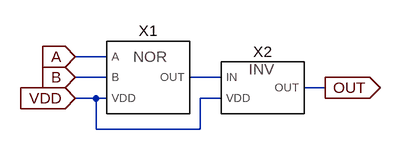
[diagram p0: schematic OrCMOS.asc]
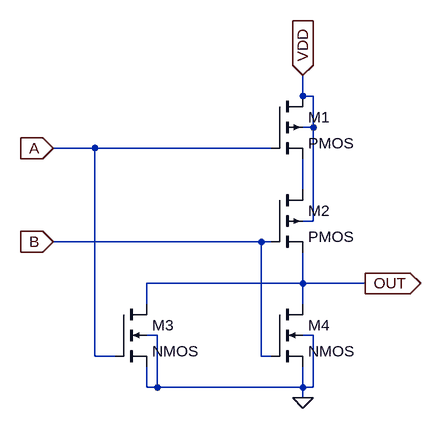
[diagram p1: sub-circuit norcmos.asc]
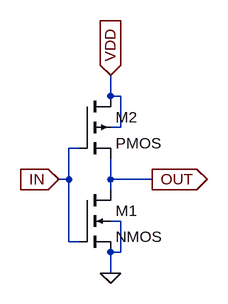
[diagram p2: sub-circuit invcmos.asc]
OrCMOS.asc, the LTspice schematic file:
Version 4
SHEET 1 880 680
WIRE 112 128 64 128
WIRE 112 160 64 160
WIRE 288 160 240 160
WIRE 448 176 416 176
WIRE 96 192 64 192
WIRE 112 192 96 192
WIRE 288 192 256 192
WIRE 96 240 96 192
WIRE 256 240 256 192
WIRE 256 240 96 240
FLAG 64 128 A
IOPIN 64 128 In
FLAG 64 160 B
IOPIN 64 160 In
FLAG 64 192 VDD
IOPIN 64 192 In
FLAG 448 176 OUT
IOPIN 448 176 Out
SYMBOL NorCMOS 176 160 R0
SYMATTR InstName X1
SYMBOL InvCMOS 352 176 R0
SYMATTR InstName X2

norcmos.asc, the sub-circuit schematic file:
Version 4
SHEET 1 880 680
WIRE 224 16 224 -16
WIRE 240 16 224 16
WIRE 240 64 240 16
WIRE 240 64 224 64
WIRE -96 96 -160 96
WIRE 176 96 -96 96
WIRE 224 160 224 112
WIRE 240 208 240 64
WIRE 240 208 224 208
WIRE 160 240 -160 240
WIRE 176 240 160 240
WIRE 224 304 224 256
WIRE 224 304 -16 304
WIRE 320 304 224 304
WIRE -16 336 -16 304
WIRE 224 336 224 304
WIRE 0 384 -16 384
WIRE 240 384 224 384
WIRE -96 416 -96 96
WIRE -64 416 -96 416
WIRE 160 416 160 240
WIRE 176 416 160 416
WIRE -16 464 -16 432
WIRE 0 464 0 384
WIRE 0 464 -16 464
WIRE 224 464 224 432
WIRE 224 464 0 464
WIRE 240 464 240 384
WIRE 240 464 224 464
WIRE 224 480 224 464
FLAG 224 480 0
FLAG 224 -16 VDD
IOPIN 224 -16 In
FLAG -160 96 A
IOPIN -160 96 In
FLAG -160 240 B
IOPIN -160 240 In
FLAG 320 304 OUT
IOPIN 320 304 Out
SYMBOL pmos4 176 16 R0
SYMATTR InstName M1
SYMATTR Value2 l=65nm w=162.5nm
SYMBOL pmos4 176 160 R0
SYMATTR InstName M2
SYMATTR Value2 l=65nm w=162.5nm
SYMBOL nmos4 -64 336 R0
SYMATTR InstName M3
SYMATTR Value2 l=65nm w=65nm
SYMBOL nmos4 176 336 R0
SYMATTR InstName M4
SYMATTR Value2 l=65nm w=65nm

invcmos.asc, the sub-circuit schematic file:
Version 4
SHEET 1 880 680
WIRE 208 32 208 0
WIRE 224 32 208 32
WIRE 224 80 224 32
WIRE 224 80 208 80
WIRE 160 112 144 112
WIRE 144 160 144 112
WIRE 144 160 128 160
WIRE 208 160 208 128
WIRE 272 160 208 160
WIRE 208 176 208 160
WIRE 224 224 208 224
WIRE 144 256 144 160
WIRE 160 256 144 256
WIRE 224 272 224 224
WIRE 224 272 208 272
WIRE 208 304 208 272
FLAG 208 304 0
FLAG 208 0 VDD
IOPIN 208 0 In
FLAG 128 160 IN
IOPIN 128 160 In
FLAG 272 160 OUT
IOPIN 272 160 Out
SYMBOL nmos4 160 176 R0
SYMATTR InstName M1
SYMATTR Value2 l=65nm w=65nm
SYMBOL pmos4 160 32 R0
SYMATTR InstName M2
SYMATTR Value2 l=65nm w=162.5nm

The netlist it stands for:
* OrCMOS.asc
XX1 A B VDD N001 norcmos
XX2 N001 VDD OUT invcmos

* block symbol definitions
.subckt norcmos A B VDD OUT
M1 VDD A N001 VDD PMOS l=65nm w=162.5nm
M2 N001 B OUT VDD PMOS l=65nm w=162.5nm
M3 OUT A 0 0 NMOS l=65nm w=65nm
M4 OUT B 0 0 NMOS l=65nm w=65nm
.ends norcmos

.subckt invcmos IN VDD OUT
M1 OUT IN 0 0 NMOS l=65nm w=65nm
M2 VDD IN OUT VDD PMOS l=65nm w=162.5nm
.ends invcmos

.model NMOS NMOS
.model PMOS PMOS
.lib standard.mos
.backanno
.end